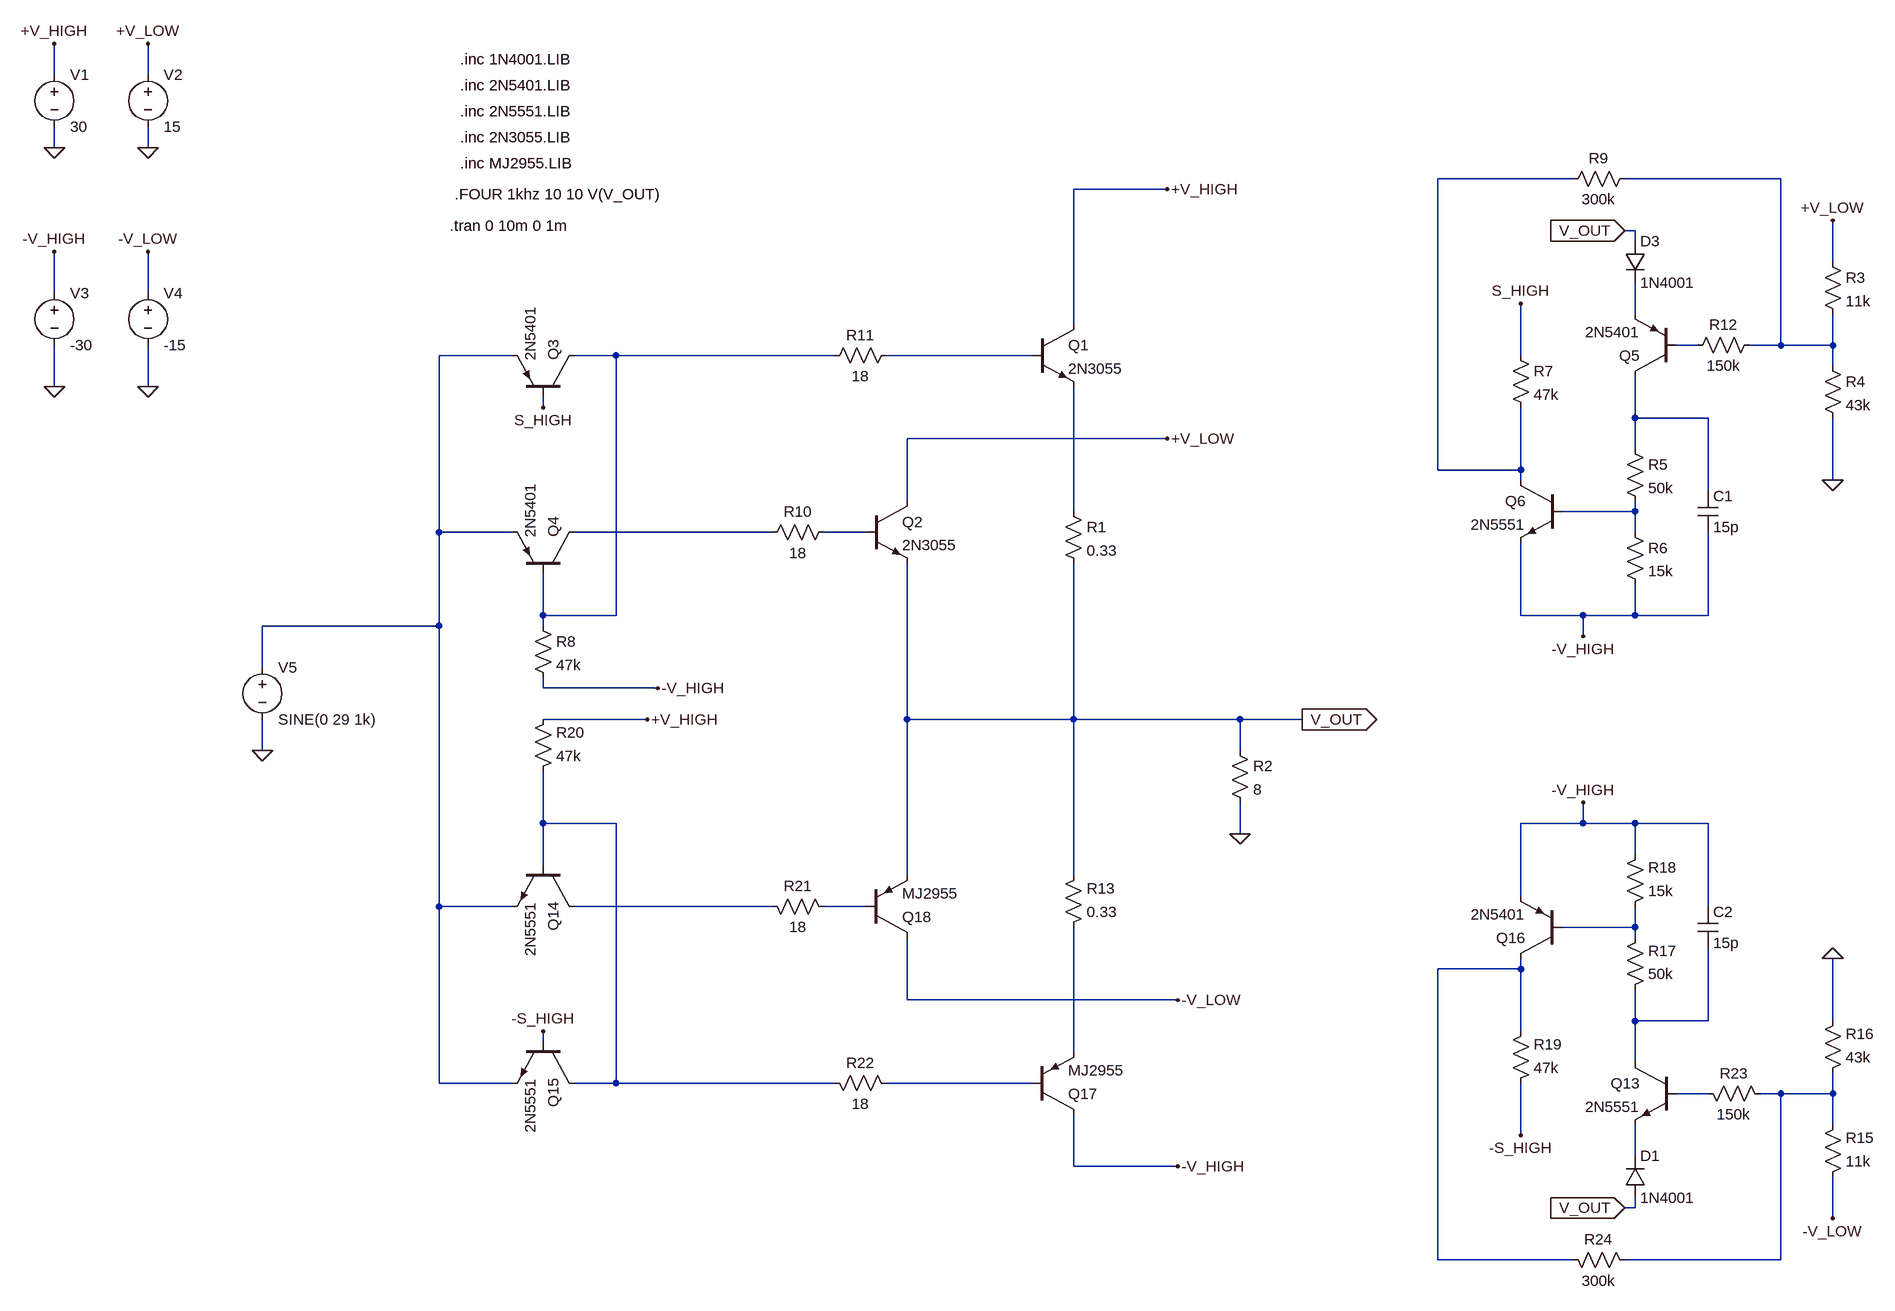
[diagram p0: schematic Salida clase G v01.asc]
Salida clase G v01.asc, the LTspice schematic file:
Version 4
SHEET 1 2036 2348
WIRE -1248 -320 -1248 -368
WIRE -1104 -320 -1104 -368
WIRE -1248 -208 -1248 -240
WIRE -1104 -208 -1104 -240
WIRE 1088 -160 880 -160
WIRE 1408 -160 1168 -160
WIRE 464 -144 320 -144
WIRE 1184 -80 1168 -80
WIRE 1184 -64 1184 -80
WIRE 1488 -32 1488 -96
WIRE -1248 16 -1248 -48
WIRE -1104 16 -1104 -48
WIRE 1184 48 1184 0
WIRE 320 64 320 -144
WIRE 1280 96 1248 96
WIRE 1408 96 1408 -160
WIRE 1408 96 1360 96
WIRE 1488 96 1488 48
WIRE 1488 96 1408 96
WIRE -544 112 -656 112
WIRE -384 112 -448 112
WIRE -48 112 -384 112
WIRE 256 112 32 112
WIRE 1008 112 1008 32
WIRE 1488 128 1488 96
WIRE -1248 160 -1248 96
WIRE -1104 160 -1104 96
WIRE -496 192 -496 176
WIRE 1184 208 1184 144
WIRE 1296 208 1184 208
WIRE 464 240 64 240
WIRE 1184 256 1184 208
WIRE 880 288 880 -160
WIRE 1008 288 1008 192
WIRE 1008 288 880 288
WIRE 1008 304 1008 288
WIRE 1488 304 1488 208
WIRE 1296 320 1296 208
WIRE 64 336 64 240
WIRE 320 352 320 160
WIRE 1184 352 1184 336
WIRE 1184 352 1072 352
WIRE -656 384 -656 112
WIRE -544 384 -656 384
WIRE -144 384 -448 384
WIRE 0 384 -64 384
WIRE 1184 384 1184 352
WIRE -496 512 -496 448
WIRE -384 512 -384 112
WIRE -384 512 -496 512
WIRE 1008 512 1008 400
WIRE 1104 512 1008 512
WIRE 1184 512 1184 464
WIRE 1184 512 1104 512
WIRE 1296 512 1296 384
WIRE 1296 512 1184 512
WIRE -656 528 -656 384
WIRE -656 528 -928 528
WIRE -496 528 -496 512
WIRE 1104 544 1104 512
WIRE -928 592 -928 528
WIRE -496 624 -496 608
WIRE -320 624 -496 624
WIRE -336 672 -496 672
WIRE 64 672 64 432
WIRE 320 672 320 432
WIRE 320 672 64 672
WIRE 576 672 320 672
WIRE 672 672 576 672
WIRE -928 720 -928 672
WIRE 576 720 576 672
WIRE -496 832 -496 752
WIRE -384 832 -496 832
WIRE 1104 832 1104 800
WIRE 1104 832 1008 832
WIRE 1184 832 1104 832
WIRE 1296 832 1184 832
WIRE 576 848 576 800
WIRE 1184 880 1184 832
WIRE -496 896 -496 832
WIRE 64 912 64 672
WIRE 320 912 320 672
WIRE 1008 944 1008 832
WIRE -656 960 -656 528
WIRE -544 960 -656 960
WIRE -144 960 -448 960
WIRE 0 960 -64 960
WIRE 1296 960 1296 832
WIRE 1184 992 1184 960
WIRE 1184 992 1072 992
WIRE 1184 1008 1184 992
WIRE 1008 1056 1008 1040
WIRE 1008 1056 880 1056
WIRE 64 1104 64 1008
WIRE 480 1104 64 1104
WIRE 1184 1136 1184 1088
WIRE 1296 1136 1296 1024
WIRE 1296 1136 1184 1136
WIRE 1488 1136 1488 1040
WIRE 1008 1152 1008 1056
WIRE -496 1168 -496 1152
WIRE 320 1184 320 992
WIRE 1184 1200 1184 1136
WIRE -656 1232 -656 960
WIRE -544 1232 -656 1232
WIRE -384 1232 -384 832
WIRE -384 1232 -448 1232
WIRE -48 1232 -384 1232
WIRE 256 1232 32 1232
WIRE 1296 1248 1248 1248
WIRE 1408 1248 1376 1248
WIRE 1488 1248 1488 1216
WIRE 1488 1248 1408 1248
WIRE 1488 1296 1488 1248
WIRE 1008 1312 1008 1232
WIRE 1184 1344 1184 1296
WIRE 320 1360 320 1280
WIRE 480 1360 320 1360
WIRE 1184 1424 1184 1408
WIRE 1184 1424 1168 1424
WIRE 1488 1440 1488 1376
WIRE 880 1504 880 1056
WIRE 1088 1504 880 1504
WIRE 1408 1504 1408 1248
WIRE 1408 1504 1168 1504
FLAG 464 -144 +V_HIGH
FLAG 464 240 +V_LOW
FLAG 576 848 0
FLAG -1248 -208 0
FLAG -1104 -208 0
FLAG -1248 -368 +V_HIGH
FLAG -1104 -368 +V_LOW
FLAG 1488 304 0
FLAG 1488 -96 +V_LOW
FLAG -1248 160 0
FLAG -1104 160 0
FLAG -1248 -48 -V_HIGH
FLAG -1104 -48 -V_LOW
FLAG 672 672 V_OUT
IOPIN 672 672 Out
FLAG 1168 -80 V_OUT
IOPIN 1168 -80 In
FLAG 1104 544 -V_HIGH
FLAG -496 192 S_HIGH
FLAG 1008 32 S_HIGH
FLAG -320 624 -V_HIGH
FLAG -928 720 0
FLAG 480 1360 -V_HIGH
FLAG 480 1104 -V_LOW
FLAG 1488 1040 0
FLAG 1488 1440 -V_LOW
FLAG 1168 1424 V_OUT
IOPIN 1168 1424 In
FLAG 1104 800 -V_HIGH
FLAG -496 1152 -S_HIGH
FLAG 1008 1312 -S_HIGH
FLAG -336 672 +V_HIGH
SYMBOL npn 256 64 R0
SYMATTR InstName Q1
SYMATTR Value 2N3055
SYMBOL npn 0 336 R0
SYMATTR InstName Q2
SYMATTR Value 2N3055
SYMBOL res 304 336 R0
SYMATTR InstName R1
SYMATTR Value 0.33
SYMBOL pnp -448 176 M270
SYMATTR InstName Q3
SYMATTR Value 2N5401
SYMBOL pnp -448 448 M270
SYMATTR InstName Q4
SYMATTR Value 2N5401
SYMBOL res 560 704 R0
SYMATTR InstName R2
SYMATTR Value 8
SYMBOL voltage -1248 -336 R0
WINDOW 123 0 0 Left 0
WINDOW 39 0 0 Left 0
SYMATTR InstName V1
SYMATTR Value 30
SYMBOL voltage -1104 -336 R0
WINDOW 123 0 0 Left 0
WINDOW 39 0 0 Left 0
SYMATTR InstName V2
SYMATTR Value 15
SYMBOL res 1472 -48 R0
SYMATTR InstName R3
SYMATTR Value 11k
SYMBOL res 1472 112 R0
SYMATTR InstName R4
SYMATTR Value 43k
SYMBOL pnp 1248 144 R180
SYMATTR InstName Q5
SYMATTR Value 2N5401
SYMBOL res 1168 240 R0
SYMATTR InstName R5
SYMATTR Value 50k
SYMBOL res 1168 368 R0
SYMATTR InstName R6
SYMATTR Value 15k
SYMBOL voltage -1248 0 R0
WINDOW 123 0 0 Left 0
WINDOW 39 0 0 Left 0
SYMATTR InstName V3
SYMATTR Value -30
SYMBOL voltage -1104 0 R0
WINDOW 123 0 0 Left 0
WINDOW 39 0 0 Left 0
SYMATTR InstName V4
SYMATTR Value -15
SYMBOL npn 1072 304 M0
SYMATTR InstName Q6
SYMATTR Value 2N5551
SYMBOL res 992 96 R0
SYMATTR InstName R7
SYMATTR Value 47k
SYMBOL res -512 512 R0
SYMATTR InstName R8
SYMATTR Value 47k
SYMBOL voltage -928 576 R0
WINDOW 123 0 0 Left 0
WINDOW 39 0 0 Left 0
SYMATTR InstName V5
SYMATTR Value SINE(0 29 1k)
SYMBOL cap 1280 320 R0
SYMATTR InstName C1
SYMATTR Value 15p
SYMBOL diode 1168 -64 R0
SYMATTR InstName D3
SYMATTR Value 1N4001
SYMBOL res -48 368 R90
WINDOW 0 0 56 VBottom 2
WINDOW 3 32 56 VTop 2
SYMATTR InstName R10
SYMATTR Value 18
SYMBOL res 48 96 R90
WINDOW 0 0 56 VBottom 2
WINDOW 3 32 56 VTop 2
SYMATTR InstName R11
SYMATTR Value 18
SYMBOL res 1376 80 R90
WINDOW 0 0 56 VBottom 2
WINDOW 3 32 56 VTop 2
SYMATTR InstName R12
SYMATTR Value 150k
SYMBOL res 1184 -176 R90
WINDOW 0 0 56 VBottom 2
WINDOW 3 32 56 VTop 2
SYMATTR InstName R9
SYMATTR Value 300k
SYMBOL res 304 1008 M180
WINDOW 0 36 76 Left 2
WINDOW 3 36 40 Left 2
SYMATTR InstName R13
SYMATTR Value 0.33
SYMBOL res 1472 1392 M180
WINDOW 0 36 76 Left 2
WINDOW 3 36 40 Left 2
SYMATTR InstName R15
SYMATTR Value 11k
SYMBOL res 1472 1232 M180
WINDOW 0 36 76 Left 2
WINDOW 3 36 40 Left 2
SYMATTR InstName R16
SYMATTR Value 43k
SYMBOL res 1168 1104 M180
WINDOW 0 36 76 Left 2
WINDOW 3 36 40 Left 2
SYMATTR InstName R17
SYMATTR Value 50k
SYMBOL res 1168 976 M180
WINDOW 0 36 76 Left 2
WINDOW 3 36 40 Left 2
SYMATTR InstName R18
SYMATTR Value 15k
SYMBOL res 992 1248 M180
WINDOW 0 36 76 Left 2
WINDOW 3 36 40 Left 2
SYMATTR InstName R19
SYMATTR Value 47k
SYMBOL res -512 768 M180
WINDOW 0 36 76 Left 2
WINDOW 3 36 40 Left 2
SYMATTR InstName R20
SYMATTR Value 47k
SYMBOL cap 1280 1024 M180
WINDOW 0 24 56 Left 2
WINDOW 3 24 8 Left 2
SYMATTR InstName C2
SYMATTR Value 15p
SYMBOL diode 1168 1408 M180
WINDOW 0 24 64 Left 2
WINDOW 3 24 0 Left 2
SYMATTR InstName D1
SYMATTR Value 1N4001
SYMBOL res -48 976 M270
WINDOW 0 32 56 VTop 2
WINDOW 3 0 56 VBottom 2
SYMATTR InstName R21
SYMATTR Value 18
SYMBOL res 48 1248 M270
WINDOW 0 32 56 VTop 2
WINDOW 3 0 56 VBottom 2
SYMATTR InstName R22
SYMATTR Value 18
SYMBOL res 1392 1264 M270
WINDOW 0 32 56 VTop 2
WINDOW 3 0 56 VBottom 2
SYMATTR InstName R23
SYMATTR Value 150k
SYMBOL res 1184 1520 M270
WINDOW 0 32 56 VTop 2
WINDOW 3 0 56 VBottom 2
SYMATTR InstName R24
SYMATTR Value 300k
SYMBOL npn 1248 1200 M0
SYMATTR InstName Q13
SYMATTR Value 2N5551
SYMBOL npn -448 896 R90
SYMATTR InstName Q14
SYMATTR Value 2N5551
SYMBOL npn -448 1168 R90
SYMATTR InstName Q15
SYMATTR Value 2N5551
SYMBOL pnp 1072 1040 R180
SYMATTR InstName Q16
SYMATTR Value 2N5401
SYMBOL pnp 256 1280 M180
SYMATTR InstName Q17
SYMATTR Value MJ2955
SYMBOL pnp 0 1008 M180
SYMATTR InstName Q18
SYMATTR Value MJ2955
TEXT -640 -88 Left 2 !.tran 0 10m 0 1m
TEXT -632 -136 Left 2 !.FOUR 1khz 10 10 V(V_OUT)
TEXT -624 -184 Left 2 !.inc MJ2955.LIB
TEXT -624 -224 Left 2 !.inc 2N3055.LIB
TEXT -624 -264 Left 2 !.inc 2N5551.LIB
TEXT -624 -304 Left 2 !.inc 2N5401.LIB
TEXT -624 -344 Left 2 !.inc 1N4001.LIB

The netlist it stands for:
* Salida clase G v01.asc
Q1 +V_HIGH N007 N009 0 2N3055
Q2 +V_LOW N012 V_OUT 0 2N3055
R1 N009 V_OUT 0.33
Q3 N006 S_HIGH N005 0 2N5401
Q4 N011 N006 N005 0 2N5401
R2 V_OUT 0 8
V1 +V_HIGH 0 30
V2 +V_LOW 0 15
R3 +V_LOW N002 11k
R4 N002 0 43k
Q5 N008 N004 N003 0 2N5401
R5 N008 N010 50k
R6 N010 -V_HIGH 15k
V3 -V_HIGH 0 -30
V4 -V_LOW 0 -15
Q6 N001 N010 -V_HIGH 0 2N5551
R7 S_HIGH N001 47k
R8 N006 -V_HIGH 47k
V5 N005 0 SINE(0 29 1k)
C1 N008 -V_HIGH 15p
D3 V_OUT N003 1N4001
R10 N012 N011 18
R11 N007 N006 18
R12 N002 N004 150k
R9 N002 N001 300k
R13 N019 V_OUT 0.33
R15 -V_LOW N022 11k
R16 N022 0 43k
R17 N018 N016 50k
R18 N016 -V_HIGH 15k
R19 -S_HIGH N017 47k
R20 N013 +V_HIGH 47k
C2 N018 -V_HIGH 15p
D1 V_OUT N023 1N4001
R21 N015 N014 18
R22 N020 N013 18
R23 N022 N021 150k
R24 N022 N017 300k
Q13 N018 N021 N023 0 2N5551
Q14 N014 N013 N005 0 2N5551
Q15 N013 -S_HIGH N005 0 2N5551
Q16 N017 N016 -V_HIGH 0 2N5401
Q17 -V_HIGH N020 N019 0 MJ2955
Q18 -V_LOW N015 V_OUT 0 MJ2955
.model D D
.lib standard.dio
.model NPN NPN
.model PNP PNP
.lib standard.bjt
.tran 0 10m 0 1m
.FOUR 1khz 10 10 V(V_OUT)
.inc MJ2955.LIB
.inc 2N3055.LIB
.inc 2N5551.LIB
.inc 2N5401.LIB
.inc 1N4001.LIB
.backanno
.end